# Altium schematic sheet MEGA Shield.SchDoc: Chronome Shield
size A; DrawnBy: Owen Vallis; Revision: 2.2
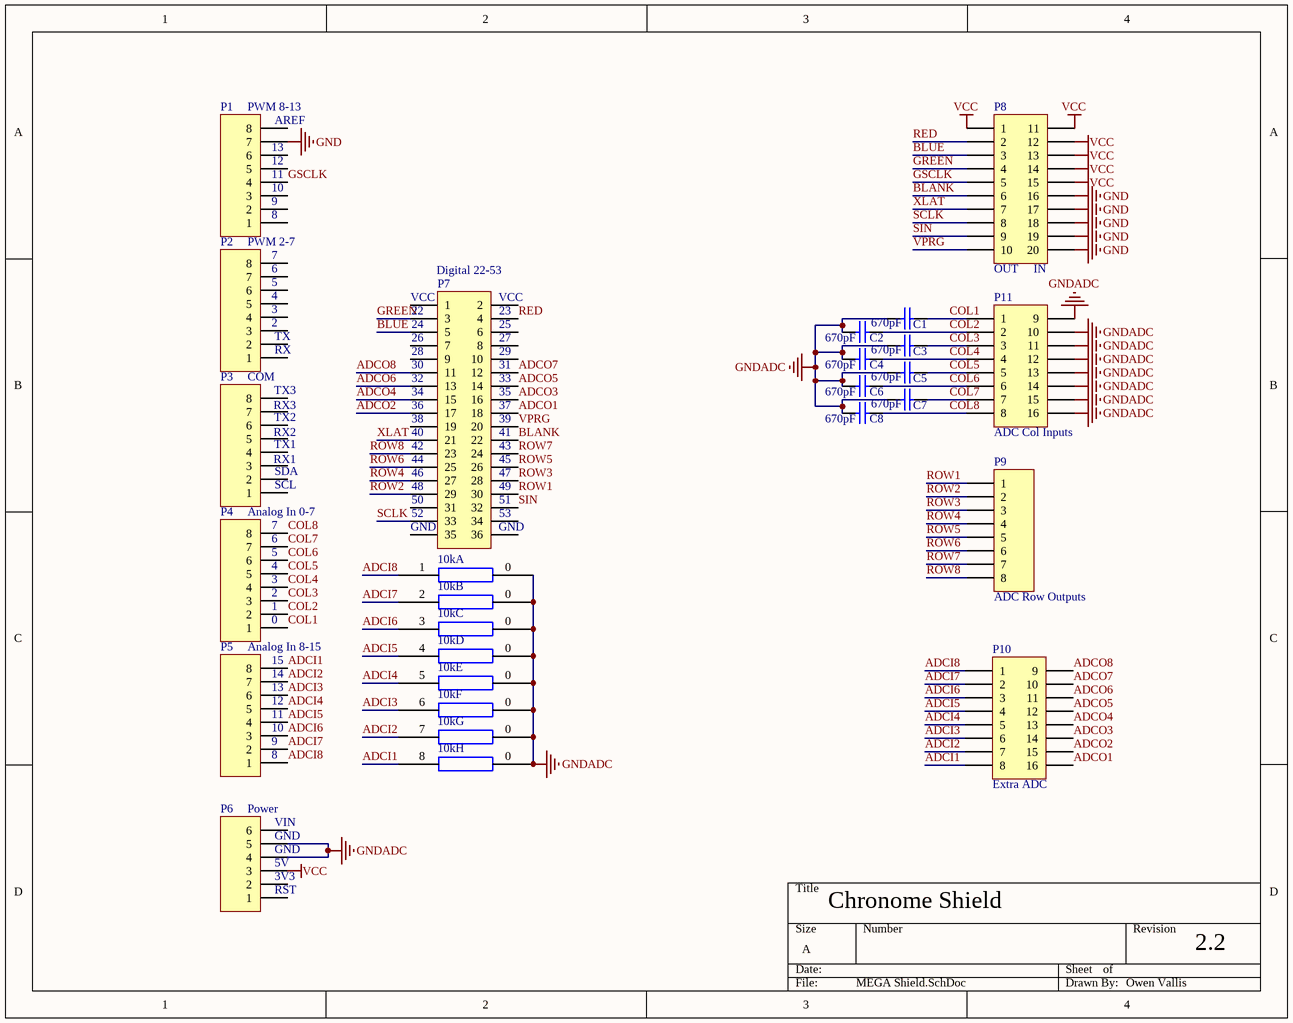
[diagram p0: MEGA Shield.SchDoc]

## Parts
10k  Res1  [9-Pin Resistor Network]  (value not drawn)  (parts A,B,C,D,E,F,G,H of 8)
C1  value 670pF  [CAPR2.54-5.1x3.2]  (hidden comment: Cap)
C2  value 670pF  [CAPR2.54-5.1x3.2]  (hidden comment: Cap)
C3  value 670pF  [CAPR2.54-5.1x3.2]  (hidden comment: Cap)
C4  value 670pF  [CAPR2.54-5.1x3.2]  (hidden comment: Cap)
C5  value 670pF  [CAPR2.54-5.1x3.2]  (hidden comment: Cap)
C6  value 670pF  [CAPR2.54-5.1x3.2]  (hidden comment: Cap)
C7  value 670pF  [CAPR2.54-5.1x3.2]  (hidden comment: Cap)
C8  value 670pF  [CAPR2.54-5.1x3.2]  (hidden comment: Cap)
P1  PWM 8-13  [HDR1X8]
P2  PWM 2-7  [HDR1X8]
P3  COM  [HDR1X8]
P4  Analog In 0-7  [HDR1X8]
P5  Analog In 8-15  [HDR1X8]
P6  Power  [HDR1X6]
P7  Digital 22-53  [HDR2X18]
P8  OUT     IN  [HDR2X10_CEN]
P9  ADC Row Outputs  [HDR1X8]
P10  Extra ADC  [HDR2X8_CEN]
P11  ADC Col Inputs  [HDR2X8_CEN]

## Nets
GND: P1.7 P8.16 P8.17 P8.18 P8.19 P8.20
GNDADC: 10k.0 C1.1 C2.1 C3.1 C4.1 C5.1 C6.1 C7.1 C8.1 P6.4 P6.5 P11.9 P11.10 P11.11 P11.12 P11.13 P11.14 P11.15 P11.16
VCC: P6.3 P8.1 P8.11 P8.12 P8.13 P8.14 P8.15
ADCI1: 10k.8 P5.8 P10.8
ADCI2: 10k.7 P5.7 P10.7
ADCI3: 10k.6 P5.6 P10.6
ADCI4: 10k.5 P5.5 P10.5
ADCI5: 10k.4 P5.4 P10.4
ADCI6: 10k.3 P5.3 P10.3
ADCI7: 10k.2 P5.2 P10.2
ADCI8: 10k.1 P5.1 P10.1
ADCO1: P7.18 P10.16
ADCO2: P7.17 P10.15
ADCO3: P7.16 P10.14
ADCO4: P7.15 P10.13
ADCO5: P7.14 P10.12
ADCO6: P7.13 P10.11
ADCO7: P7.12 P10.10
ADCO8: P7.11 P10.9
BLANK: P7.22 P8.6
BLUE: P7.5 P8.3
COL1: C1.2 P4.1 P11.1
COL2: C2.2 P4.2 P11.2
COL3: C3.2 P4.3 P11.3
COL4: C4.2 P4.4 P11.4
COL5: C5.2 P4.5 P11.5
COL6: C6.2 P4.6 P11.6
COL7: C7.2 P4.7 P11.7
COL8: C8.2 P4.8 P11.8
GREEN: P7.3 P8.4
GSCLK: P1.4 P8.5
RED: P7.4 P8.2
ROW1: P7.30 P9.1
ROW2: P7.29 P9.2
ROW3: P7.28 P9.3
ROW4: P7.27 P9.4
ROW5: P7.26 P9.5
ROW6: P7.25 P9.6
ROW7: P7.24 P9.7
ROW8: P7.23 P9.8
SCLK: P7.33 P8.8
SIN: P7.32 P8.9
VPRG: P7.20 P8.10
XLAT: P7.21 P8.7

Not connected (* = marked no-connect by the designer): P1 1 2 3 5 6 8; P2 1 2 3 4 5 6 7 8; P3 1 2 3 4 5 6 7 8; P6 1 2 6; P7 1 2 6 7 8 9 10 19 31 34 35 36

## Notes on the sheet
- (near P1) 12
- (near P1) 13
- (near P1) AREF
- (near P1) 8
- (near P1) 9
- (near P1) 10
- (near P1) 11
- (near P2) 4
- (near P2) 5
- (near P2) 6
- (near P2) 7
- (near P7) VCC
- (near P2) 2
- (near P2) 3
- (near P2) TX
- (near P2) RX
- (near P7) 22
- (near P7) 24
- (near P7) 26
- (near P7) 28
- (near P7) 30
- (near P7) 23
- (near P7) 25
- (near P7) 27
- (near P7) 29
- (near P7) 31
- (near P3) RX2
- (near P3) RX3
- (near P3) TX2
- (near P3) TX3
- (near P7) 32
- (near P7) 34
- (near P7) 36
- (near P7) 38
- (near P7) 40
- (near P7) 33
- (near P7) 35
- (near P7) 37
- (near P7) 39
- (near P7) 41
- (near P3) RX1
- (near P3) TX1
- (near P3) SCL
- (near P3) SDA
- (near P7) 42
- (near P7) 44
- (near P7) 46
- (near P7) 48
- (near P7) 50
- (near P7) 43
- (near P7) 45
- (near P7) 47
- (near P7) 49
- (near P7) 51
- (near P4) 4
- (near P4) 5
- (near P4) 6
- (near P4) 7
- (near P7) GND
- (near P7) 52
- (near P7) 53
- (near P4) 0
- (near P4) 1
- (near P4) 2
- (near P4) 3
- (near P5) 12
- (near P5) 13
- (near P5) 14
- (near P5) 15
- (near P5) 8
- (near P5) 9
- (near P5) 10
- (near P5) 11
- (near P6) GND
- (near P6) VIN
- (near P6) RST
- (near P6) 5V
- (near P6) 3V3

## Library data of the parts
C1-C8 = Cap: Capacitor; Published: 8-Jun-2000; LatestRevisionDate: 17-Jul-2002; LatestRevisionNote: Re-released for DXP Platform.; PackageReference: RAD-0.3; Publisher: Altium Limited
P1-P5 P9 = Header 8: Header, 8-Pin; LatestRevisionDate: 17-Jul-2002; LatestRevisionNote: Re-released for DXP Platform.; Publisher: Altium Limited
P6 = Header 6: Header, 6-Pin; LatestRevisionDate: 17-Jul-2002; LatestRevisionNote: Re-released for DXP Platform.; Publisher: Altium Limited
P7 = Header 18X2: Header, 18-Pin, Dual row; LatestRevisionDate: 17-Jul-2002; LatestRevisionNote: Re-released for DXP Platform.; Publisher: Altium Limited
P8 = Header 10X2A: Header, 10-Pin, Dual row; LatestRevisionDate: 17-Jul-2002; LatestRevisionNote: Re-released for DXP Platform.; Publisher: Altium Limited
P10 P11 = Header 8X2A: Header, 8-Pin, Dual row; LatestRevisionDate: 17-Jul-2002; LatestRevisionNote: Re-released for DXP Platform.; Publisher: Altium Limited